# Altium schematic sheet WiFi_BLE.SchDoc
size A
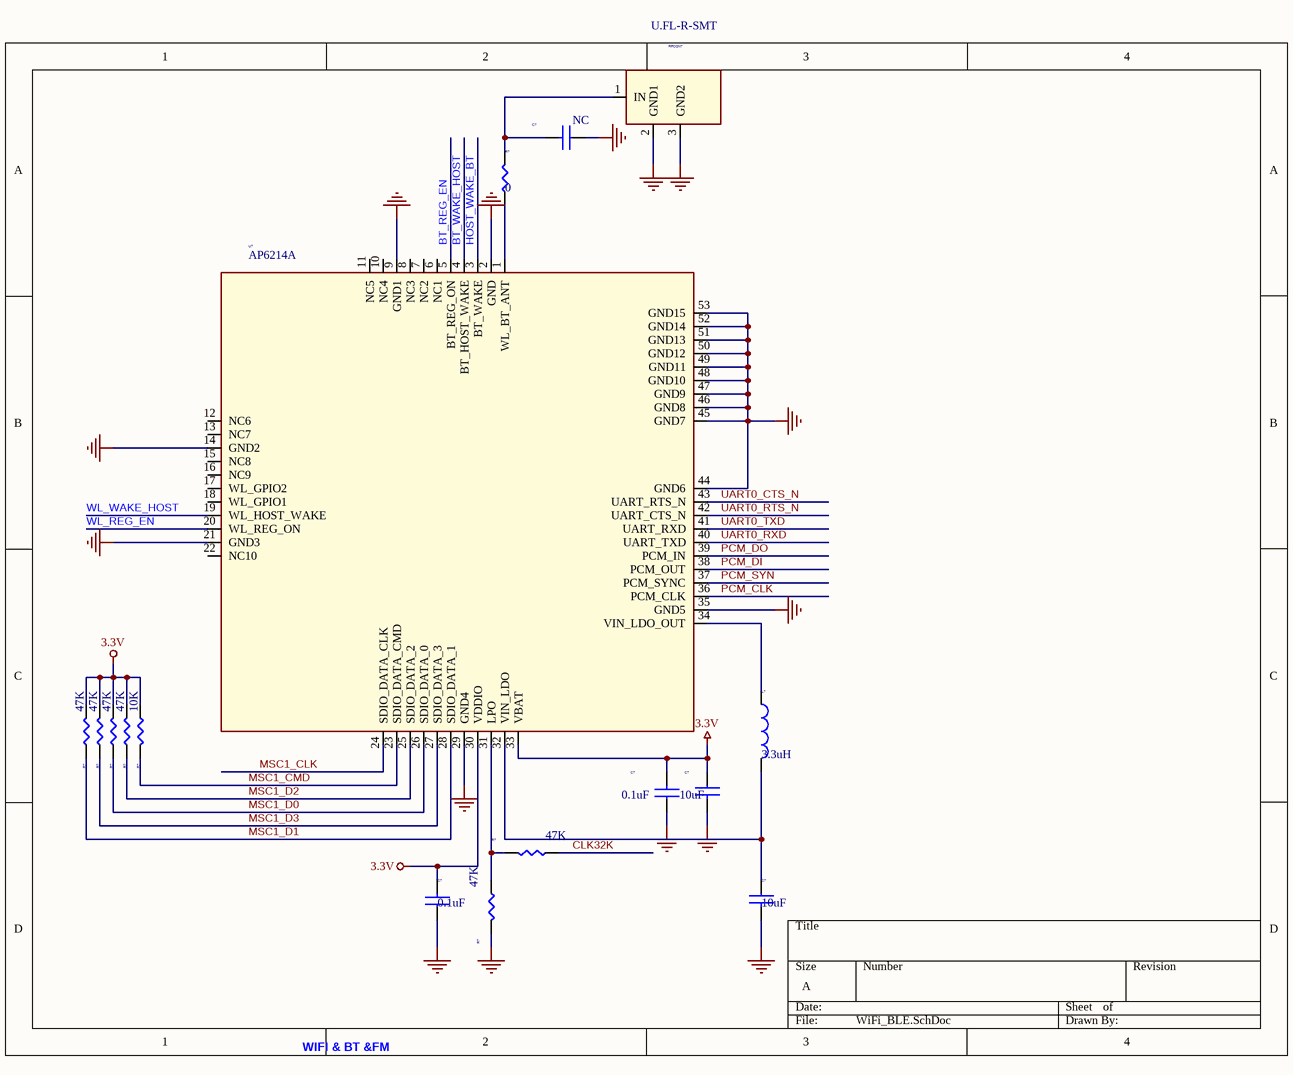
[diagram p0: WiFi_BLE.SchDoc]

## Parts
(Parts that share a designator on the sheet are numbered #1, #2 ... from top to bottom, then left to right.)
C?#1  NC  [CAP_0402]
C?#2  10uF  [C0402+]
C?#3  0.1uF  [CAP_0402]
C?#4  10uF  [C0402+]
C?#5  0.1uF  [CAP_0402]
L?  3.3uH  [IND_1210]
R?#1  0  [RES_0402]
R?#2  10K  [RES_0402]
R?#3  47K  [RES_0402]
R?#4  47K  [RES_0402]
R?#5  47K  [RES_0402]
R?#6  47K  [RES_0402]
R?#7  47K  [RES_0402]
R?#8  47K  [RES_0402]
RFCON?  U.FL-R-SMT  [IPEX]
U?  AP6214A  [AP6214A]

## Nets
3.3V: C?#2.1 C?#3.2 C?#5.2 R?#2.1 R?#3.2 R?#4.2 R?#5.2 R?#6.2 U?.30(VDDIO) U?.33(VBAT)
GND: C?#1.1 C?#2.2 C?#3.1 C?#4.2 C?#5.1 R?#8.1 RFCON?.2(GND1) RFCON?.3(GND2) U?.2(GND) U?.9(GND1) U?.14(GND2) U?.21(GND3) U?.29(GND4) U?.35(GND5) U?.44(GND6) U?.45(GND7) U?.46(GND8) U?.47(GND9) U?.48(GND10) U?.49(GND11) U?.50(GND12) U?.51(GND13) U?.52(GND14) U?.53(GND15)
BT_REG_EN: U?.5(BT_REG_ON)
BT_WAKE_HOST: U?.4(BT_HOST_WAKE)
CLK32K: R?#7.2
HOST_WAKE_BT: U?.3(BT_WAKE)
MSC1_CLK: U?.24(SDIO_DATA_CLK)
MSC1_CMD: R?#2.2 U?.23(SDIO_DATA_CMD)
MSC1_D0: R?#5.1 U?.26(SDIO_DATA_0)
MSC1_D1: R?#3.1 U?.28(SDIO_DATA_1)
MSC1_D2: R?#6.1 U?.25(SDIO_DATA_2)
MSC1_D3: R?#4.1 U?.27(SDIO_DATA_3)
PCM_CLK: U?.36(PCM_CLK)
PCM_DI: U?.38(PCM_OUT)
PCM_DO: U?.39(PCM_IN)
PCM_SYN: U?.37(PCM_SYNC)
UART0_CTS_N: U?.43(UART_RTS_N)
UART0_RTS_N: U?.42(UART_CTS_N)
UART0_RXD: U?.40(UART_TXD)
UART0_TXD: U?.41(UART_RXD)
WL_REG_EN: U?.20(WL_REG_ON)
WL_WAKE_HOST: U?.19(WL_HOST_WAKE)
NetC?#1_2: C?#1.2 R?#1.1 RFCON?.1(IN)
NetC?#4_1: C?#4.1 L?.1 U?.32(VIN_LDO)
NetL?_2: L?.2 U?.34(VIN_LDO_OUT)
NetR?#1_2: R?#1.2 U?.1(WL_BT_ANT)
NetR?#7_1: R?#7.1 R?#8.2 U?.31(LPO)

Not connected (* = marked no-connect by the designer): U? 6(NC1) 7(NC2) 8(NC3) 10(NC4) 11(NC5) 12(NC6) 13(NC7) 15(NC8) 16(NC9) 17(WL_GPIO2) 18(WL_GPIO1) 22(NC10)

## Notes on the sheet
- WIFI & BT &FM

## Library data of the parts
C?#1 = CAP_NP: 1ST PART DESCRIPTION: CAP 22pF NP0 +/-10% 50V
C?#2 = CAP NP: Part Number: C0402X5R106M6R3NTC; 1ST PART DESCRIPTION: CAP 10uF X5R +/-20% 6.3V; OriginalSymbolOrigin: (0,0); Pin Numbers Visible: False; Pin Names Rotate: True; Pin Names Visible: False
C?#3 = CAP_NP: Part Number: C0402X5R104M6R3NTB; 1ST PART DESCRIPTION: CAP 0.1uF X5R +/-20% 6.3V
C?#4 = CAP NP: 1ST PART DESCRIPTION: CAP 10uF X5R +/-20% 6.3V; Part Number: C0402X5R106M6R3NTC; OriginalSymbolOrigin: (0,0); Pin Numbers Visible: False; Pin Names Rotate: True; Pin Names Visible: False
C?#5 = CAP NP: Part Number: C0402X5R104M6R3NTB; 1ST PART DESCRIPTION: CAP 0.1uF X5R +/-20% 6.3V; OriginalSymbolOrigin: (0,0); Pin Names Rotate: True; Pin Names Visible: False; Pin Numbers Visible: False
L? = INDUCTOR: Part Number: PSD20161T-2R2MS; 1ST PART DESCRIPTION: CYNTEC PCSB20161T-3R3MS  3.3uH POWER INDUCTOR; OriginalSymbolOrigin: (10,0); Pin Names Rotate: True; Pin Names Visible: False; Pin Numbers Visible: False
R?#1 = R_10_Dup1: 1ST PART DESCRIPTION: RESISTOR 0 OHM 1/16 5%; OriginalSymbolOrigin: (0,0); Pin Numbers Visible: False; Pin Names Rotate: True; Pin Names Visible: False
R?#2 = R_10_Dup1: Part Number: 10KOHM; 1ST PART DESCRIPTION: RESISTOR 10K OHM 1/16 5%; OriginalSymbolOrigin: (0,0); Pin Names Rotate: True; Pin Names Visible: False; Pin Numbers Visible: False
R?#3 R?#7 = R_MINI: Part Number: 47KOHM; 1ST PART DESCRIPTION: RESISTOR 47K OHM 1/16 5%; OriginalSymbolOrigin: (0,0); Pin Numbers Visible: False; Pin Names Rotate: True; Pin Names Visible: False
R?#4 R?#6 = R_MINI: Part Number: 47KOHM; 1ST PART DESCRIPTION: RESISTOR 47K OHM 1/16 5%; OriginalSymbolOrigin: (0,0); Pin Names Rotate: True; Pin Names Visible: False; Pin Numbers Visible: False
R?#5 = R_MINI: 1ST PART DESCRIPTION: RESISTOR 47K OHM 1/16 5%; Part Number: 47KOHM; OriginalSymbolOrigin: (0,0); Pin Names Rotate: True; Pin Names Visible: False; Pin Numbers Visible: False
R?#8 = R_MINI: 1ST PART DESCRIPTION: RESISTOR 47K OHM 1/16 5%; Part Number: 47KOHM; OriginalSymbolOrigin: (0,0); Pin Numbers Visible: False; Pin Names Rotate: True; Pin Names Visible: False
RFCON? = ANT_0: 1ST PART DESCRIPTION: U.FL-R-SMT
U? = AP6493_0: 1ST PART DESCRIPTION: AMPEK WiFi+BT+FM AP6212; ORCAD_LIB: MODULE; QVL: AMPAK; Device: AMPAK_SIP